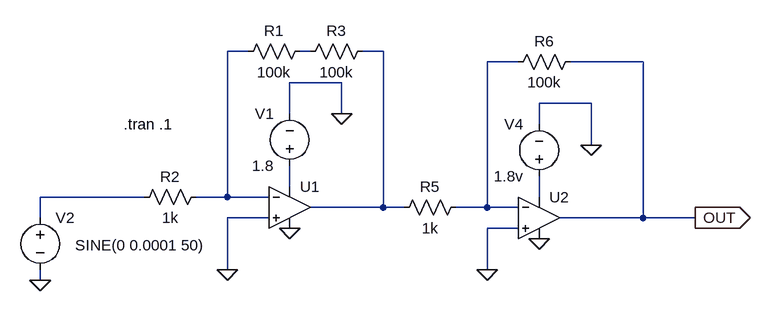
[diagram p0: schematic Draft1.asc]
Draft1.asc, the LTspice schematic file:
Version 4
SHEET 1 1604 680
WIRE 128 -80 96 -80
WIRE 224 -80 208 -80
WIRE 336 -80 304 -80
WIRE 544 -64 496 -64
WIRE 736 -64 624 -64
WIRE 272 -32 192 -32
WIRE 656 0 576 0
WIRE 192 16 192 -32
WIRE 272 16 272 -32
WIRE 576 32 576 0
WIRE 656 64 656 0
WIRE 192 128 192 96
WIRE -32 144 -192 144
WIRE 96 144 96 -80
WIRE 96 144 48 144
WIRE 160 144 96 144
WIRE 576 144 576 112
WIRE 336 160 336 -80
WIRE 336 160 224 160
WIRE 368 160 336 160
WIRE 496 160 496 -64
WIRE 496 160 448 160
WIRE 544 160 496 160
WIRE -192 176 -192 144
WIRE 160 176 96 176
WIRE 736 176 736 -64
WIRE 736 176 608 176
WIRE 816 176 736 176
WIRE 544 192 496 192
WIRE 96 256 96 176
WIRE 496 256 496 192
WIRE -192 272 -192 256
FLAG 192 192 0
FLAG 272 16 0
FLAG -192 272 0
FLAG 96 256 0
FLAG 496 256 0
FLAG 576 208 0
FLAG 656 64 0
FLAG 816 176 OUT
IOPIN 816 176 Out
SYMBOL OpAmps\\UniversalOpAmp 192 160 R0
SYMATTR InstName U1
SYMBOL voltage 192 112 R180
WINDOW 0 24 96 Left 2
WINDOW 3 24 16 Left 2
WINDOW 123 0 0 Left 0
WINDOW 39 0 0 Left 0
SYMATTR InstName V1
SYMATTR Value 1.8
SYMBOL voltage -192 160 R0
WINDOW 3 54 58 Left 2
WINDOW 123 0 0 Left 0
WINDOW 39 0 0 Left 0
SYMATTR Value SINE(0 0.0001 50)
SYMATTR InstName V2
SYMBOL res 64 128 R90
WINDOW 0 0 56 VBottom 2
WINDOW 3 32 56 VTop 2
SYMATTR InstName R2
SYMATTR Value 1k
SYMATTR SpiceLine tol=1
SYMBOL res 464 144 R90
WINDOW 0 0 56 VBottom 2
WINDOW 3 32 56 VTop 2
SYMATTR InstName R5
SYMATTR Value 1k
SYMATTR SpiceLine tol=1
SYMBOL OpAmps\\UniversalOpAmp 576 176 R0
SYMATTR InstName U2
SYMBOL voltage 576 128 R180
WINDOW 0 24 96 Left 2
WINDOW 3 24 16 Left 2
WINDOW 123 0 0 Left 0
WINDOW 39 0 0 Left 0
SYMATTR InstName V4
SYMATTR Value 1.8v
SYMBOL res 640 -80 R90
WINDOW 0 0 56 VBottom 2
WINDOW 3 32 56 VTop 2
SYMATTR InstName R6
SYMATTR Value 100k
SYMATTR SpiceLine tol=1
SYMBOL res 224 -96 R90
WINDOW 0 0 56 VBottom 2
WINDOW 3 32 56 VTop 2
SYMATTR InstName R1
SYMATTR Value 100k
SYMATTR SpiceLine tol=1
SYMBOL res 320 -96 R90
WINDOW 0 0 56 VBottom 2
WINDOW 3 32 56 VTop 2
SYMATTR InstName R3
SYMATTR Value 100k
SYMATTR SpiceLine tol=1
TEXT -64 32 Left 2 !.tran .1

The netlist it stands for:
* Draft1.asc
XU1 0 N001 N005 0 N003 level1 Avol=1Meg GBW=10Meg Vos=0 En=0 Enk=0 In=0 Ink=0 Rin=500Meg  ; pins In+ In- V+ V- OUT
V1 N005 0 1.8
V2 N006 0 SINE(0 0.0001 50)
R2 N001 N006 1k tol=1
R5 N004 N003 1k tol=1
XU2 0 N004 N007 0 OUT level1 Avol=1Meg GBW=10Meg Vos=0 En=0 Enk=0 In=0 Ink=0 Rin=500Meg  ; pins In+ In- V+ V- OUT
V4 N007 0 1.8v
R6 OUT N004 100k tol=1
R1 N002 N001 100k tol=1
R3 N003 N002 100k tol=1
.tran .1
.lib UniversalOpAmp1.lib
.backanno
.end